# EasyEDA Pro project ProPrj_DSP BOARD_2026-03-01.epro, board PCB1
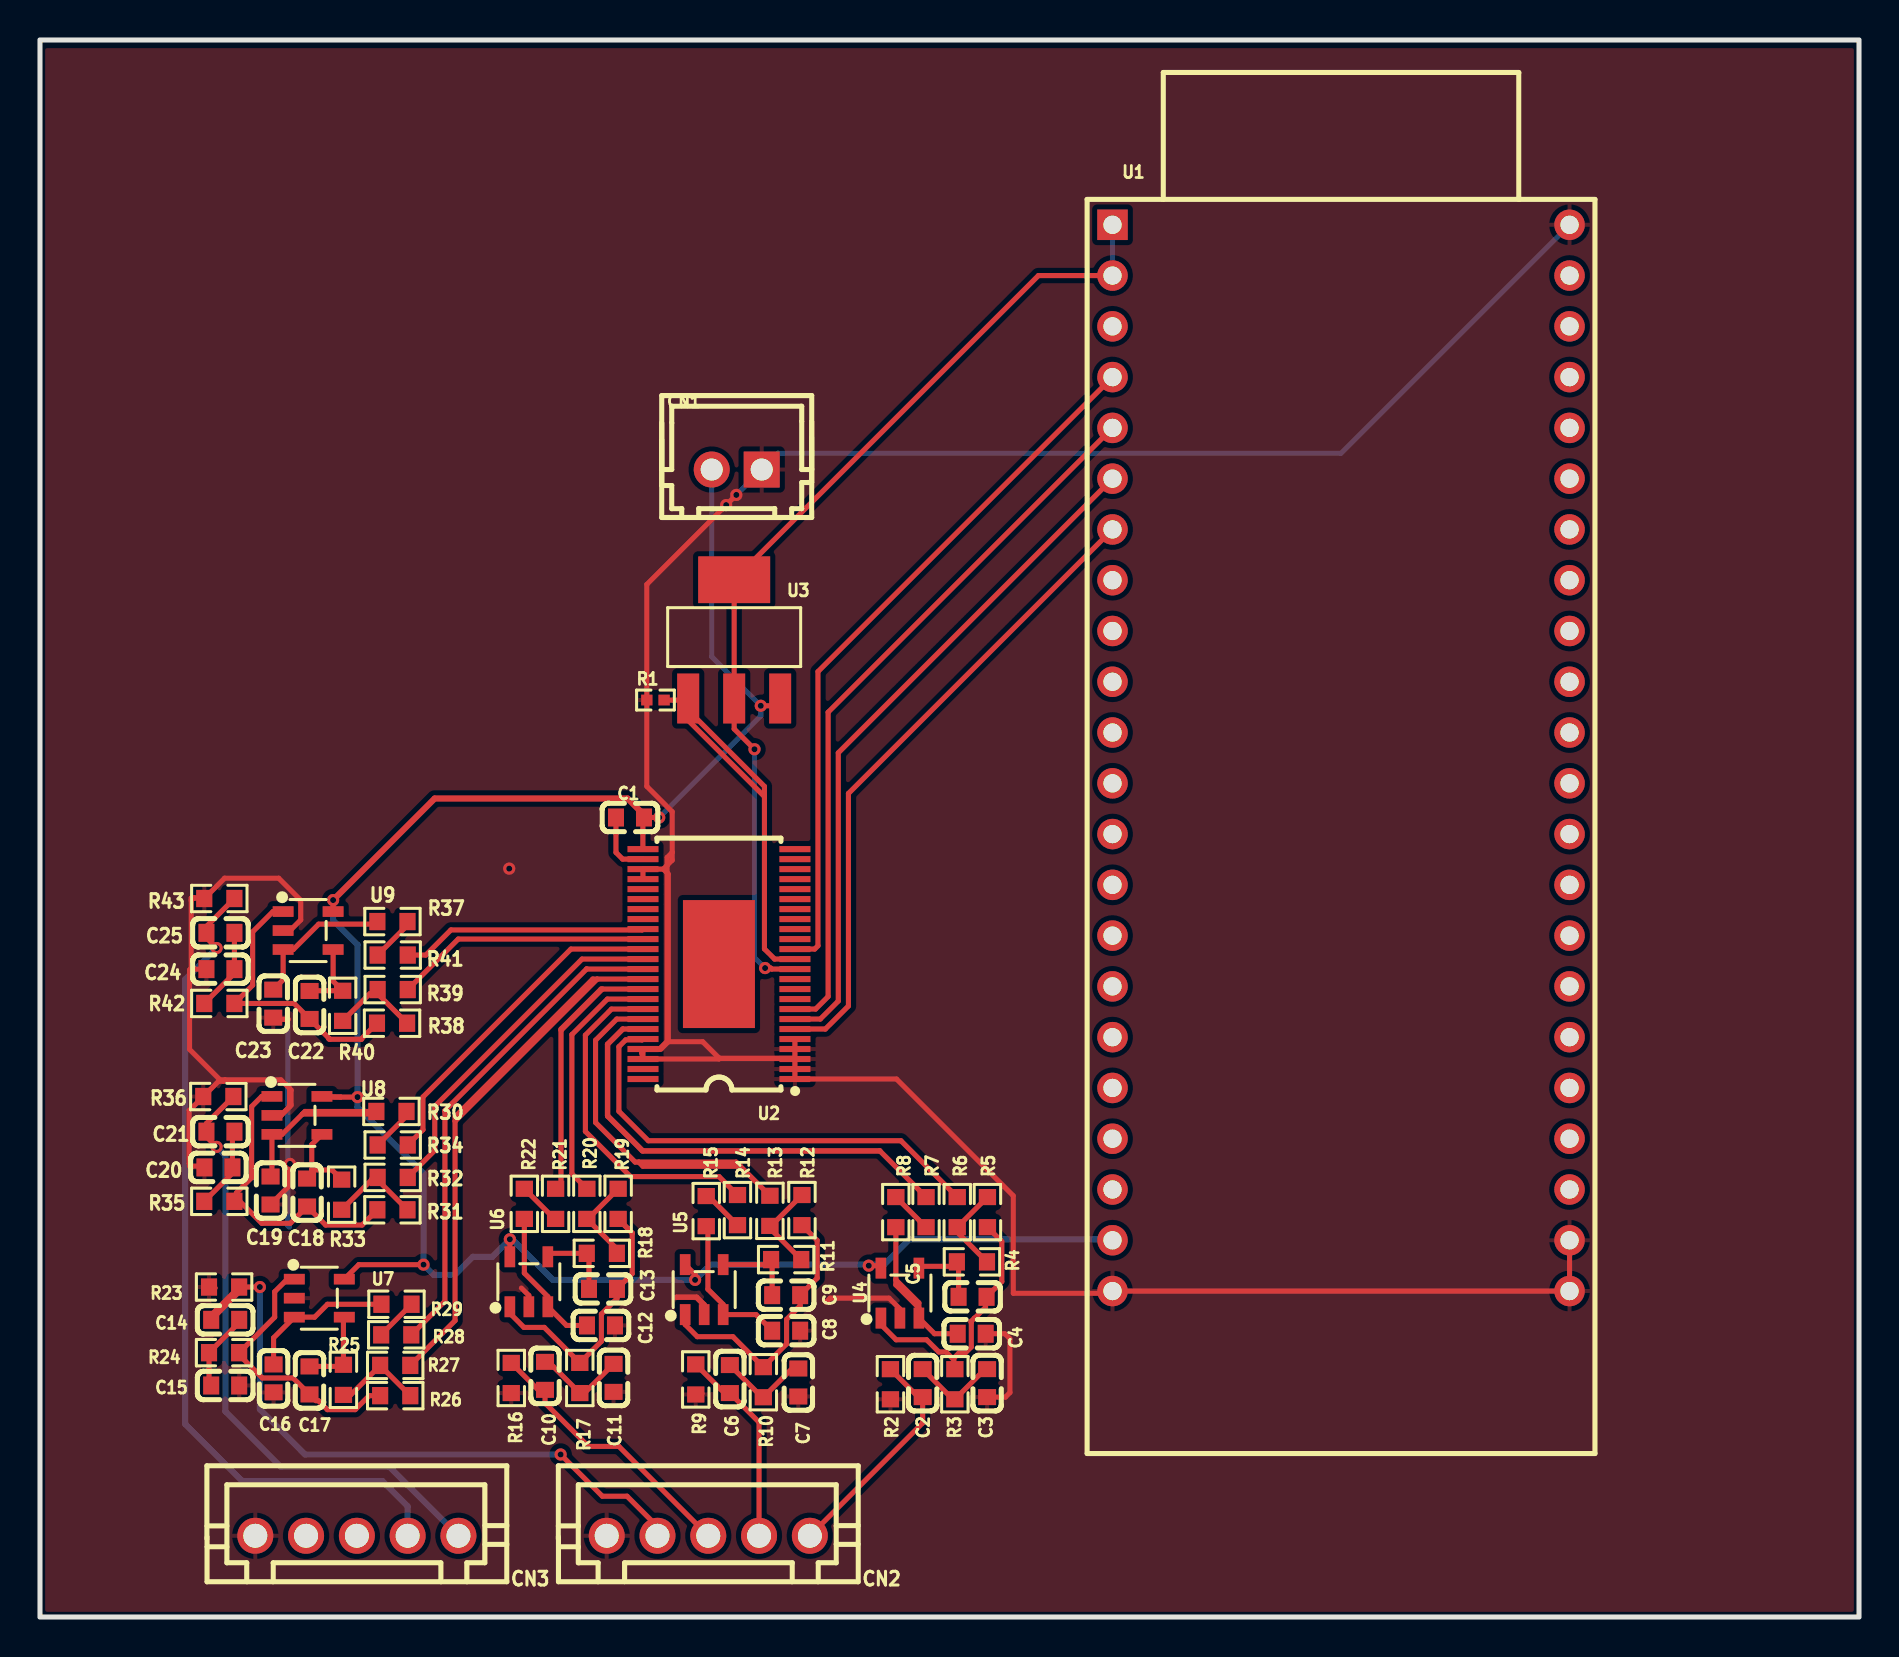
[diagram p2: board, top side]
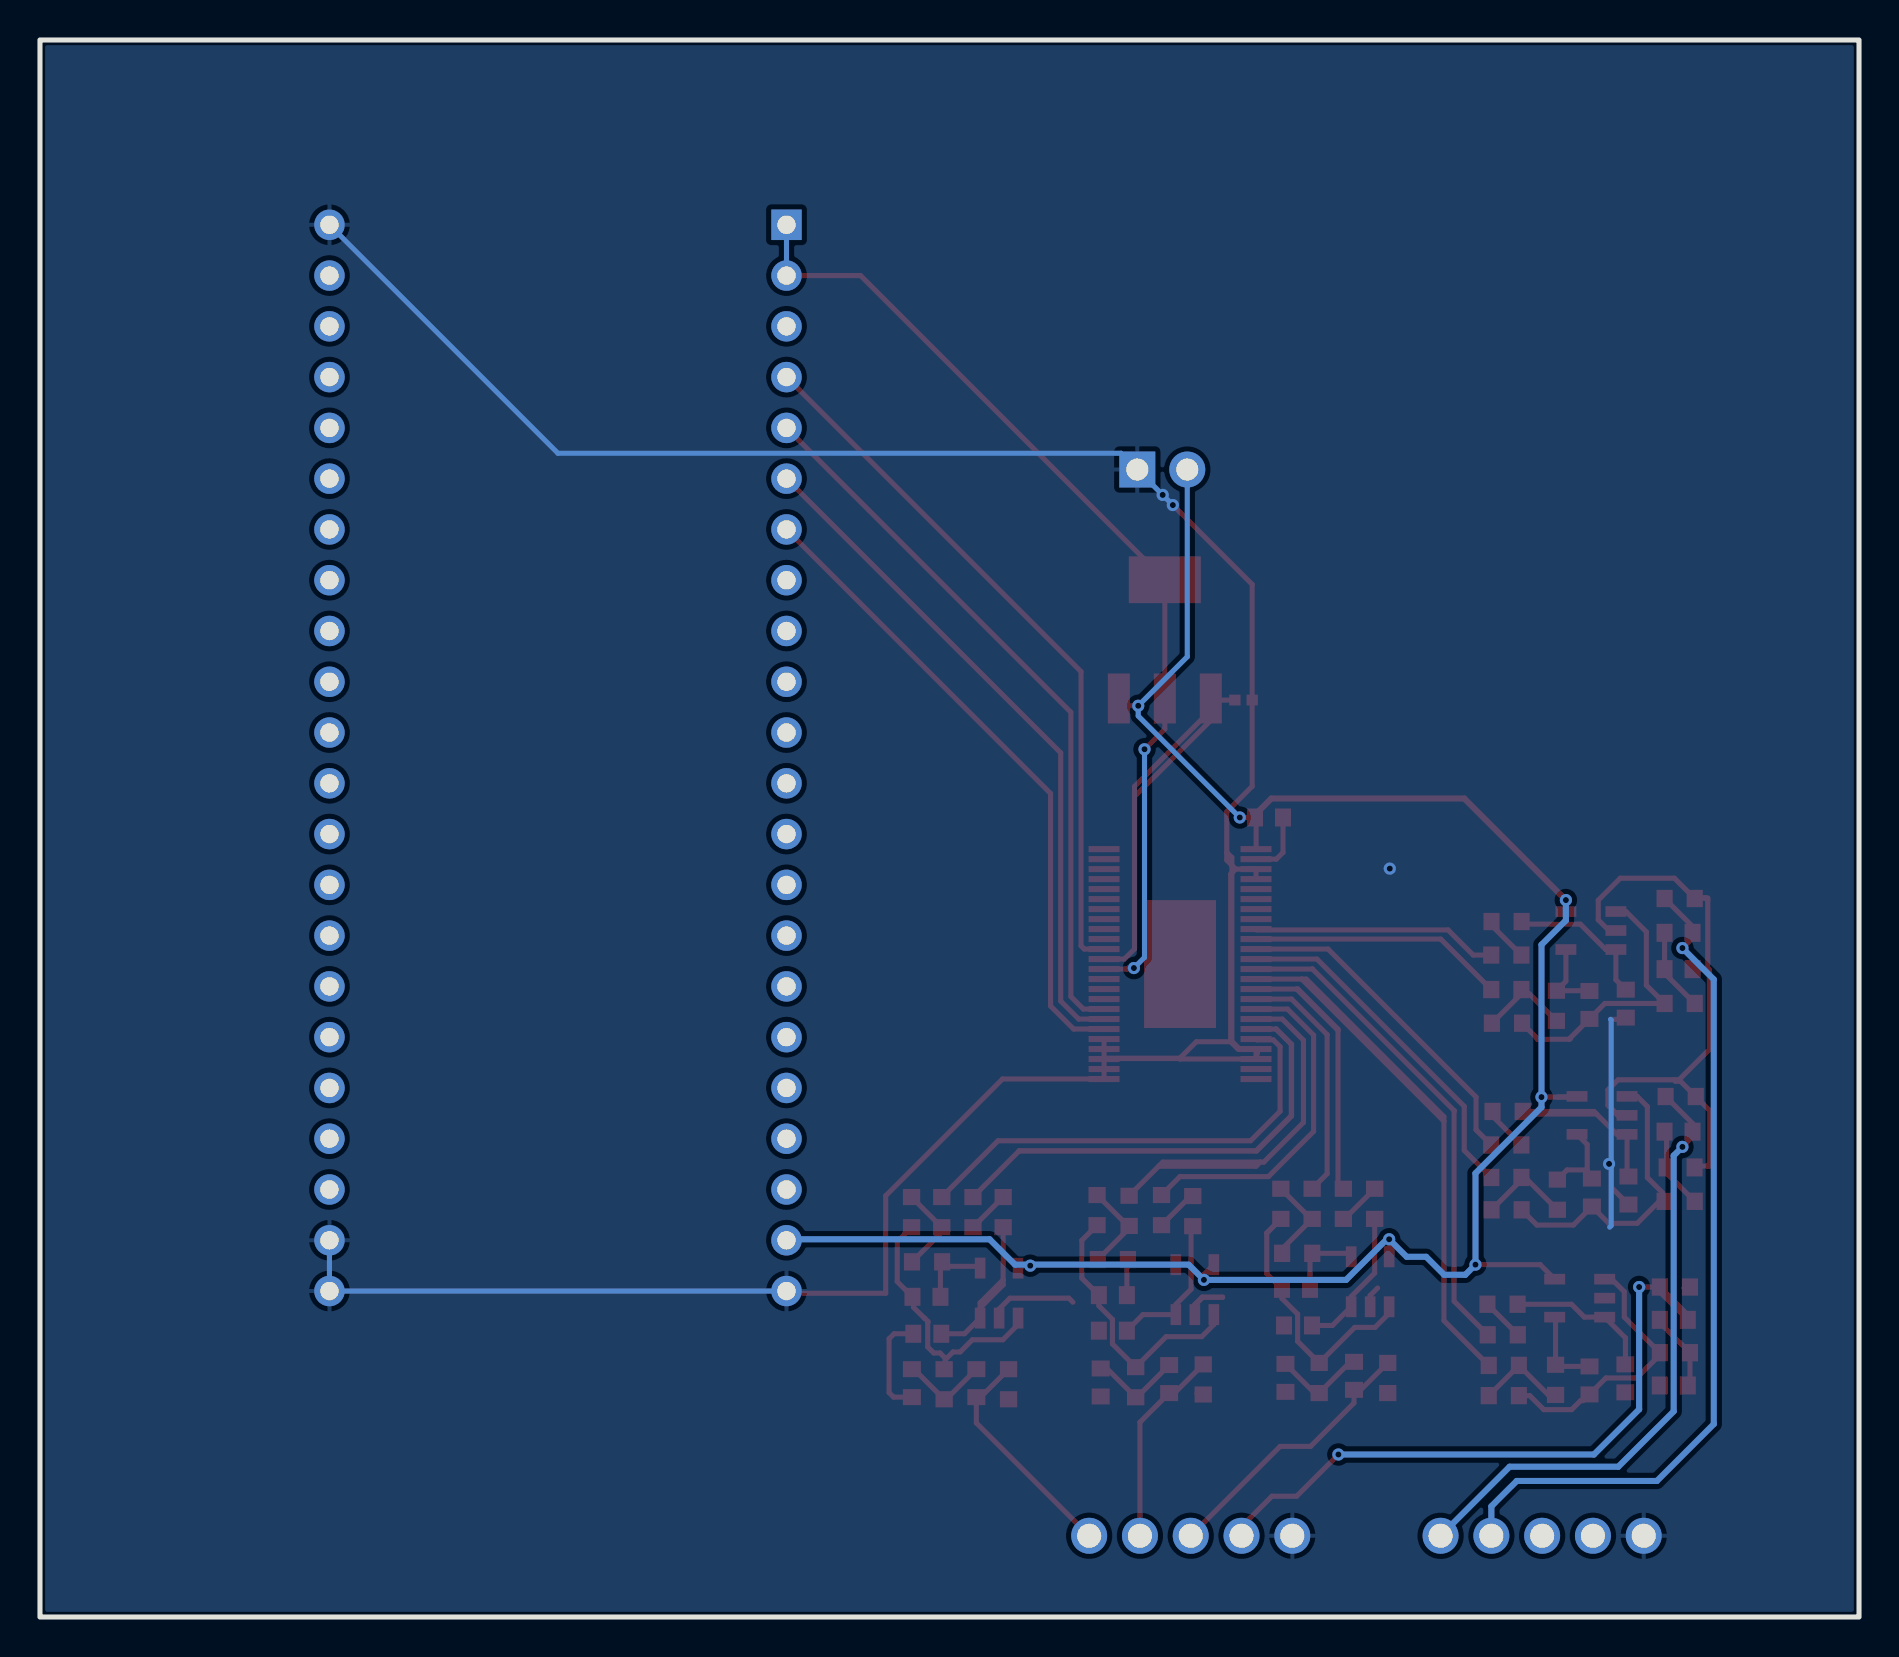
[diagram p3: board, bottom side, seen from below]

Outline 90.98 x 78.89 mm; copper layers: Top Layer, Bottom Layer. Coordinates in mm from the lower left corner of the outline.
Outline path: rectangle 0,78.89 90.98,0
Stack: Top Layer 0.035mm / Dielectric1 1.51mm FR4 er 4.5 / Bottom Layer 0.035mm

## Design rules (mm)
template: Custom Config
spacing copperThickness1oz: track to track 0.102, other pairs 0.152 to 0.3
spacing copperThickness2oz (default): track to track 0.203, other pairs 0.152 to 0.3
track width copperThickness1oz (default): min 0.127, default 0.254, max 2.54
track width copperThickness2oz: min 0.203, default 0.254, max 2.54
differential pair differentialPair (default): width min 0.127, default 0.254, max 2.54; gap min 0.152, default 0.152
via viaSize (default): diameter min 0.5, default 0.61, max 10; hole min 0.3, default 0.305, max 6.3

## Placement (name value [footprint] x y rotation side)
C1  10uF  [C0603]  29.51 40 180 top
C2  10uF  [C0603]  44.15 11.7 270 top
C3  330pF  [C0603]  47.37 11.7 270 top
C4  100pF  [C0603]  46.6 14.17 180 top
C5  100pF  [C0603]  46.65 16.02 0 top
C6  10uF  [C0603]  34.51 11.9 270 top
C7  330pF  [C0603]  37.93 11.73 270 top
C8  100pF  [C0603]  37.32 14.32 180 top
C9  100pF  [C0603]  37.32 16.1 0 top
C10  10uF  [C0603]  25.26 12.06 270 top
C11  330pF  [C0603]  28.69 11.96 270 top
C12  100pF  [C0603]  28.06 14.59 180 top
C13  100pF  [C0603]  28.16 16.41 0 top
C14  10uF  [C0603]  9.26 14.87 180 top
C15  330pF  [C0603]  9.26 11.58 0 top
C16  100pF  [C0603]  11.68 11.94 90 top
C17  100pF  [C0603]  13.48 11.84 270 top
C18  100pF  [C0603]  13.36 21.23 270 top
C19  100pF  [C0603]  11.53 21.34 90 top
C20  330pF  [C0603]  8.92 22.49 180 top
C21  10uF  [C0603]  9.03 24.28 180 top
C22  100pF  [C0603]  13.49 30.62 270 top
C23  100pF  [C0603]  11.67 30.68 90 top
C24  330pF  [C0603]  9.03 32.41 180 top
C25  10uF  [C0603]  9.03 34.23 180 top
CN1  ZX-XH2.54-2PZZ  [CONN-TH_2P-P2.50_HX25003-2A]  34.85 57.4 180 top
CN2  XH2.54-5P  [CONN-TH_5P-P2.54_C9900008095]  33.43 4.06 180 top
CN3  XH2.54-5P  [CONN-TH_5P-P2.54_C9900008095]  15.85 4.06 180 top
R1  0Ω  [R0402]  30.78 45.87 0 top
R2  47kΩ  [R0603]  42.54 11.64 90 top
R3  10kΩ  [R0603]  45.76 11.64 270 top
R4  10kΩ  [R0603]  46.61 17.77 180 top
R5  15kΩ  [R0603]  47.39 20.26 270 top
R6  10kΩ  [R0603]  45.88 20.26 270 top
R7  10kΩ  [R0603]  44.32 20.26 270 top
R8  15kΩ  [R0603]  42.81 20.26 270 top
R9  47kΩ  [R0603]  32.8 11.89 90 top
R10  10kΩ  [R0603]  36.18 11.75 270 top
R11  10kΩ  [R0603]  37.32 17.88 180 top
R12  15kΩ  [R0603]  38.11 20.36 270 top
R13  10kΩ  [R0603]  36.51 20.32 270 top
R14  10kΩ  [R0603]  34.89 20.36 270 top
R15  15kΩ  [R0603]  33.33 20.31 270 top
R16  47kΩ  [R0603]  23.57 11.96 90 top
R17  10kΩ  [R0603]  27 11.96 270 top
R18  10kΩ  [R0603]  28.1 18.19 180 top
R19  15kΩ  [R0603]  28.92 20.67 270 top
R20  10kΩ  [R0603]  27.35 20.67 270 top
R21  10kΩ  [R0603]  25.79 20.67 270 top
R22  15kΩ  [R0603]  24.23 20.67 270 top
R23  47kΩ  [R0603]  9.21 16.51 0 top
R24  10kΩ  [R0603]  9.21 13.22 180 top
R25  10kΩ  [R0603]  15.18 11.86 90 top
R26  15kΩ  [R0603]  17.77 11.07 180 top
R27  10kΩ  [R0603]  17.77 12.59 180 top
R28  10kΩ  [R0603]  17.82 14.12 180 top
R29  15kΩ  [R0603]  17.83 15.65 180 top
R30  15kΩ  [R0603]  17.58 25.29 180 top
R31  15kΩ  [R0603]  17.63 20.37 180 top
R32  10kΩ  [R0603]  17.64 21.99 180 top
R33  10kΩ  [R0603]  15.09 21.13 90 top
R34  10kΩ  [R0603]  17.64 23.61 180 top
R35  10kΩ  [R0603]  8.97 20.8 180 top
R36  47kΩ  [R0603]  8.92 26.04 0 top
R37  15kΩ  [R0603]  17.63 34.79 180 top
R38  15kΩ  [R0603]  17.61 29.7 180 top
R39  10kΩ  [R0603]  17.64 31.39 180 top
R40  10kΩ  [R0603]  15.14 30.58 90 top
R41  10kΩ  [R0603]  17.64 33.11 180 top
R42  10kΩ  [R0603]  8.97 30.69 180 top
R43  47kΩ  [R0603]  8.97 35.94 0 top
U1  ESP32-S3-DEVKITC-1-N8  [CONN-TH_ESP32-S3-DEVKITC-1U-N8]  65.07 42.98 0 top
U2  PCM1690DCAR  [HTSSOP-48_L12.5-W6.1-P0.50-LS8.1-BL-EP-1]  33.96 32.66 90 top
U3  AMS1117-3.3  [SOT-223-3_L6.5-W3.5-P3.05-LS7.0]  34.72 48.92 270 top
U4  OPA356AIDBVTG4  [SOT-23-5_L3.0-W1.5-P0.95-LS2.8-BL]  43.01 16.2 0 top
U5  OPA356AIDBVTG4  [SOT-23-5_L3.0-W1.5-P0.95-LS2.8-BL]  33.22 16.38 0 top
U6  OPA356AIDBVTG4  [SOT-23-5_L3.0-W1.5-P0.95-LS2.8-BL]  24.45 16.77 0 top
U7  OPA356AIDBVTG4  [SOT-23-5_L3.0-W1.5-P0.95-LS2.8-BL]  13.97 15.95 270 top
U8  OPA356AIDBVTG4  [SOT-23-5_L3.0-W1.5-P0.95-LS2.8-BL]  12.85 25.09 270 top
U9  OPA356AIDBVTG4  [SOT-23-5_L3.0-W1.5-P0.95-LS2.8-BL]  13.41 34.34 270 top

## Footprints (pads in the part's own frame, mm; a bottom-side part is the same pattern mirrored in y, then rotated)
C0603
  rect 0.8x0.9 smd: 1(-0.7,0) 2(0.7,0)
CONN-TH_2P-P2.50_HX25003-2A
  rect 1.8x1.8 hole 1.1: 1(-1.25,0)
  round 1.8 hole 1.1: 2(1.25,0)
CONN-TH_5P-P2.54_C9900008095
  round 1.8 hole 1.2: 1(-5.08,0) 2(-2.54,0) 3(0,0) 4(2.541,0) 5(5.08,0)
CONN-TH_ESP32-S3-DEVKITC-1U-N8
  rect 1.524x1.524 hole 0.914: 1(-11.43,26.67)
  round 1.524 hole 0.914: 2(-11.43,24.13) 3(-11.43,21.59) 4(-11.43,19.05) 5(-11.43,16.51) 6(-11.43,13.97) 7(-11.43,11.43) 8(-11.43,8.89) 9(-11.43,6.35) 10(-11.43,3.81) 11(-11.43,1.27) 12(-11.43,-1.27) 13(-11.43,-3.81) 14(-11.43,-6.35) 15(-11.43,-8.89) 16(-11.43,-11.43) 17(-11.43,-13.97) 18(-11.43,-16.51) 19(-11.43,-19.05) 20(-11.43,-21.59) 21(-11.43,-24.13) 22(-11.43,-26.67) 23(11.43,-26.67) 24(11.43,-24.13) 25(11.43,-21.59) 26(11.43,-19.05) 27(11.43,-16.51) 28(11.43,-13.97) 29(11.43,-11.43) 30(11.43,-8.89) 31(11.43,-6.35) 32(11.43,-3.81) 33(11.43,-1.27) 34(11.43,1.27) 35(11.43,3.81) 36(11.43,6.35) 37(11.43,8.89) 38(11.43,11.43) 39(11.43,13.97) 40(11.43,16.51) 41(11.43,19.05) 42(11.43,21.59) 43(11.43,24.13) 44(11.43,26.67)
HTSSOP-48_L12.5-W6.1-P0.50-LS8.1-BL-EP-1
  rect 0.305x1.55 smd: 1(-5.75,-3.8) 2(-5.25,-3.8) 3(-4.75,-3.8) 4(-4.25,-3.8) 5(-3.75,-3.8) 6(-3.25,-3.8) 7(-2.75,-3.8) 8(-2.25,-3.8) 9(-1.75,-3.8) 10(-1.25,-3.8) 11(-0.75,-3.8) 12(-0.25,-3.8) 13(0.25,-3.8) 14(0.75,-3.8) 15(1.25,-3.8) 16(1.75,-3.8) 17(2.25,-3.8) 18(2.75,-3.8) 19(3.25,-3.8) 20(3.75,-3.8) 21(4.25,-3.8) 22(4.75,-3.8) 23(5.25,-3.8) 24(5.75,-3.8) 25(5.75,3.8) 26(5.25,3.8) 27(4.75,3.8) 28(4.25,3.8) 29(3.75,3.8) 30(3.25,3.8) 31(2.75,3.8) 32(2.25,3.8) 33(1.75,3.8) 34(1.25,3.8) 35(0.75,3.8) 36(0.25,3.8) 37(-0.25,3.8) 38(-0.75,3.8) 39(-1.25,3.8) 40(-1.75,3.8) 41(-2.25,3.8) 42(-2.75,3.8) 43(-3.25,3.8) 44(-3.75,3.8) 45(-4.25,3.8) 46(-4.75,3.8) 47(-5.25,3.8) 48(-5.75,3.8)
  rect 6.4x3.6 smd: 49(0,0)
R0402
  rect 0.566x0.54 smd: 1(-0.433,0) 2(0.433,0)
R0603
  rect 0.806x0.864 smd: 1(-0.753,0) 2(0.753,0)
SOT-23-5_L3.0-W1.5-P0.95-LS2.8-BL
  rect 0.532x1.045 smd: 1(-0.95,-1.25) 2(0,-1.25) 3(0.95,-1.25) 4(0.95,1.25) 5(-0.95,1.25)
SOT-223-3_L6.5-W3.5-P3.05-LS7.0
  rect 2.5x1.1 smd: 1(2.97,-2.3) 2(2.97,0) 3(2.97,2.3)
  rect 2.34x3.6 smd: 4(-2.97,0)

## Nets
As in the schematic.

Pads without a net: U2 9 10 11 15 16 17 18 19 20 21 22 23 24 48 49

## Via types
v1: diameter 0.61, hole 0.305, Top Layer to Bottom Layer, 18 vias

## Routing (per net, layer and track width the routed paths; a pad name or vN(x,y) marks a point on that pad's centre or on a via; arc(x,y) is an arc through that point)
3V3: length 49.3
  Top Layer w0.254: v1(36.27,32.47) 36.55,32.47 36.6,32.41 U2.12 ; U1.2 49.94,67.11 U3.4 U3.2 34.72,44.43 v1(35.74,43.41)
  Bottom Layer w0.254: v1(35.74,43.41) 35.74,33 v1(36.27,32.47) ; U1.2 U1.1
+5V: length 109.7
  Top Layer w0.254: U7.5 15.95,17.63 v1(19.18,17.63) ; v1(23.5,18.9) U6.5 ; v1(36.05,45.58) 36.66,45.58 U3.3 ; v1(14.66,35.87) U9.5 ; 30.15,39.93 C1.1 ; 30.15,39.93 30.15,40.12 C1.1 ; 30.15,39.93 30.15,38.42 ; C1.1 v1(30.97,40) ; v1(41.45,17.58) 41.94,17.58 U4.5 ; 15.05,26.01 U8.5 14.14,26.01 15.05,26.01 ; 15.05,26.01 v1(15.88,26.01) ; U5.5 32.77,17.13 v1(32.77,16.87)
  Top Layer w0.305: 30.15,40.12 30.15,40.18 29.39,40.95 19.74,40.95 v1(14.66,35.87)
  Bottom Layer w0.254: v1(30.97,40) 36.05,45.08 v1(36.05,45.58) 33.6,48.04 CN1.2
  Bottom Layer w0.305: U1.21 53.59,18.9 43.48,18.9 42.21,17.63 41.5,17.63 v1(41.45,17.58) 41.4,17.63 33.53,17.63 v1(32.77,16.87) 25.65,16.87 23.62,18.9 v1(23.5,18.9) 22.62,18.02 21.65,18.02 20.75,17.12 19.69,17.12 v1(19.18,17.63) 19.18,22.2 15.88,25.5 v1(15.88,26.01) 15.88,33.63 14.66,34.85 v1(14.66,35.87)
AGND: length 246.6
  Top Layer w0.254: C19.1 12.39,21.5 12.39,22.56 v1(12.5,22.67) ; 31.37,37.61 31.18,37.41 ; 31.37,37.61 31.37,38 31.62,38.25 ; 31.37,37.61 31.62,37.86 31.62,38.25 ; 31.37,37.61 31.37,37.22 ; 31.18,37.41 31.37,37.22 ; 31.18,37.41 U2.27 U2.28 ; 31.62,38.25 31.62,40.28 30.35,41.55 R1.1 30.35,51.66 v1(34.32,55.63) v1(34.83,56.13) ; 31.37,37.22 31.37,28.8 30.98,28.41 ; 31.37,37.22 31.43,37.16 31.43,28.78 ; 12.05,25.09 U8.2 ; 12.05,25.09 12.48,25.53 12.48,26.44 ; 12.05,25.09 12.05,25.09 12.56,25.6 12.56,26.36 12.48,26.44 ; 12.48,26.44 12.05,26.87 9.25,26.87 ; 30.98,28.41 30.96,28.4 30.18,28.4 U2.45 ; 30.98,28.41 31.07,28.41 31.43,28.78 ; 30.98,28.41 U2.45 ; 8.13,35.86 8.22,35.86 R43.1 ; 8.13,35.86 8.02,35.97 ; 8.13,35.86 R43.1 ; 9.25,26.87 9.01,26.87 ; 9.25,26.87 9.18,26.8 8.93,26.8 ; 37.73,27.94 U2.3 ; 37.73,27.94 33.98,27.94 ; 37.73,27.94 37.72,27.95 34,27.95 33.98,27.94 ; U2.3 U2.4 U2.5 ; U2.3 U2.2 U2.1 42.84,26.91 48.68,21.07 48.68,16.2 53.53,16.2 U1.22 U1.23 U1.24 ; 33.98,27.94 33.96,27.91 U2.46 ; 33.98,27.94 33.15,28.78 31.43,28.78 ; 9.01,26.87 7.48,28.4 7.48,32.37 7.52,32.41 7.56,32.41 ; 9.01,26.87 8.93,26.8 ; 7.53,22.6 7.48,22.65 ; 7.53,22.6 7.48,22.55 7.48,22.65 ; 7.53,22.6 7.58,22.55 8.16,22.55 8.16,22.49 8.22,22.49 ; 7.48,22.65 7.46,22.67 7.46,25.33 R36.1 8.93,26.8 8.93,26.8 ; 7.67,35.97 8.02,35.97 ; 7.67,35.97 7.69,35.98 8.01,35.98 8.02,35.97 ; 7.67,35.97 7.56,35.86 ; 7.67,35.97 7.56,35.97 7.56,35.86 ; 39.32,15.75 39.52,15.95 42.47,15.95 43.01,15.41 U4.2 ; 33.22,15.6 32.82,16 31.83,16 31.84,16 32.85,16 33.22,15.64 33.22,15.6 ; 33.22,15.6 U5.2 ; U2.46 30.1,28.21 30.1,28.35 U2.45 ; U2.46 U2.45 ; R43.1 9.23,36.96 11.94,36.96 13.04,35.86 13.04,34.87 12.51,34.34 U9.2 ; U6.2 24.45,16.09 24.08,16.46 ; 7.56,35.86 7.56,32.41 ; 7.56,32.41 C24.2 ; 12.43,29.9 11.75,29.9 C23.1 ; C4.1 48.26,14.17 48.51,13.92 48.51,11.23 48.29,11 C3.2 ; 33.11,11.18 R9.1 32.97,11.3 32.97,11.32 33.11,11.18 ; 42.67,11.03 42.4,11.03 R2.1 42.67,11.03 ; 8.5,16.46 R23.1 8.75,16.46 8.5,16.46
  Bottom Layer w0.254: v1(34.32,55.63) v1(34.83,56.13) CN1.1 36.91,58.22 65.07,58.22 U1.44 ; U1.22 U1.23 U1.24 ; 12.47,19.5 12.39,19.58 12.39,29.86 12.43,29.9
  vias: v1(23.47,37.44)
DGND: length 22.9
  Top Layer w0.254: 36.24,41.04 36.24,41.55 32.43,45.36 ; 36.24,41.04 36.24,33.42 36.74,32.91 U2.13 ; 36.24,41.04 32.43,44.85 32.43,45.36 ; 32.43,45.87 31.22,45.87 ; 32.43,45.87 U3.1 ; 32.43,45.87 32.43,45.36
GPI04: length 35.8
  Top Layer w0.254: U2.14 38.75,33.41 38.91,33.58 38.91,47.29 U1.4
GPI05: length 36.3
  Top Layer w0.254: U2.8 38.8,30.41 39.42,31.04 39.42,45.26 U1.5
GPI06: length 34.4
  Top Layer w0.254: U1.6 39.93,43.23 39.93,30.81 39.03,29.91 U2.7
GPI07: length 32.5
  Top Layer w0.254: 53.64,54.41 40.44,41.2 40.44,30.57 39.28,29.41 U2.6
OUT1: length 11.5
  Top Layer w0.254: 38.51,4.06 44.15,9.71 C2.2 43.93,11 R2.2
OUT2: length 10
  Top Layer w0.254: CN2.2 35.97,9.74 C6.2 34.23,11.2 R9.2
OUT3: length 13.8
  Top Layer w0.254: CN2.3 28.96,8.53 27.43,8.53 25.26,10.71 C10.2 24.92,11.36 R16.2
OUT4: length 34.4
  Top Layer w0.254: v1(11,16.51) R23.2 ; R23.2 8.56,15.11 C14.2 9.96,16.26 R23.2 ; v1(26.04,8.13) 28.13,6.04 29.36,6.04 30.89,4.52 30.89,4.06
  Bottom Layer w0.305: v1(26.04,8.13) 13.26,8.13 11,10.39 v1(11,16.51)
OUT5: length 30.9
  Top Layer w0.254: v1(8.83,23.52) 8.33,24.03 C21.2 8.33,24.69 R36.2
  Bottom Layer w0.305: v1(8.83,23.52) 9.27,23.08 9.27,10.29 12.04,7.52 17.47,7.52 CN3.1
OUT6: length 42
  Top Layer w0.254: R43.2 8.33,34.55 C25.2 8.33,33.97 v1(8.83,33.47)
  Bottom Layer w0.305: CN3.2 18.39,5.54 17.12,6.81 10.11,6.81 7.26,9.65 7.26,31.9 v1(8.83,33.47)
OUT_1N: length 23.3
  Top Layer w0.254: R6.1 43.06,23.82 30.43,23.82 28.96,25.3 28.96,28.53 29.29,28.87 30.12,28.87 U2.44
OUT_1P: length 42.3
  Top Layer w0.254: 29.16,29.41 28.4,28.65 28.4,25.08 ; 29.16,29.41 U2.43 ; 29.16,29.41 29.14,29.41 28.38,28.65 28.38,25.1 28.4,25.08 ; 28.4,25.08 30.16,23.32 42.01,23.32 42.01,23.32 ; 28.4,25.08 28.4,25.04 30.12,23.32 42.01,23.32 ; 42.01,23.32 R7.1
OUT_2N: length 22.3
  Top Layer w0.254: U2.42 28.85,29.91 27.79,28.85 27.79,24.74 29.77,22.76 29.95,22.76 ; 29.95,22.76 34.82,22.76 35.03,22.55 ; 29.95,22.76 30.16,22.55 35.03,22.55 ; 35.03,22.55 R13.1
OUT_2P: length 17.2
  Top Layer w0.254: U2.41 28.59,30.41 27.28,29.11 27.28,24.29 29.54,22.03 33.96,22.03 R14.1
OUT_3N: length 12.3
  Top Layer w0.254: U2.40 28.38,30.91 26.6,29.14 26.6,22.17 R20.1
OUT_3P: length 16
  Top Layer w0.254: R21.1 26.06,21.69 26.06,29.35 ; 28.13,31.41 U2.39 ; 28.13,31.41 28.06,31.41 26.06,29.41 26.06,29.35 ; 28.13,31.41 26.06,29.35
OUT_4N: length 35.7
  Top Layer w0.254: U2.38 27.87,31.91 ; 27.87,31.91 20.76,24.8 ; 27.87,31.91 27.65,31.91 20.76,25.03 20.76,24.8 ; 20.76,24.8 20.76,14.83 R27.1
OUT_4P: length 24.8
  Top Layer w0.254: 27.35,32.43 27.33,32.41 ; 27.33,32.41 U2.37 ; 27.33,32.41 20.25,25.33 ; 20.25,25.33 20.24,25.32 ; 20.25,25.33 20.25,15.8 R28.1
OUT_5N: length 17.6
  Top Layer w0.254: R32.1 19.75,23.34 19.75,25.55 27.11,32.91 U2.36
OUT_5P: length 16.8
  Top Layer w0.254: R34.1 19.16,24.38 19.16,26.01 26.56,33.41 U2.35
OUT_6N: length 12.8
  Top Layer w0.254: U2.34 20.92,33.91 R39.1
OUT_6P: length 12.3
  Top Layer w0.254: R41.1 19.3,33.11 20.55,34.37 30.12,34.37 U2.33
$1N5043: length 3.2
  Top Layer w0.254: 28.81,40 28.81,38.25 29.14,37.91 U2.26
$1N12831: length 4
  Top Layer w0.254: 45.95,17.54 R4.2 45.95,17.68 45.95,17.54 ; 45.95,17.54 44.05,17.54 U4.4 ; 45.95,17.54 C5.1
$1N12836: length 4.5
  Top Layer w0.254: R4.1 45.88,19.25 R6.2 ; 45.88,19.5 R5.1
$1N12844: length 2.1
  Top Layer w0.254: 44.31,19.5 R8.1
$1N12849: length 9.2
  Top Layer w0.254: 42.81,16.87 R8.2 ; 42.81,16.87 42.81,16.61 43.96,15.46 ; 42.81,16.87 43.96,15.72 43.96,15.46 ; 43.96,15.46 U4.3 44.74,14.17 C4.2
$1N12960: length 13.2
  Top Layer w0.254: R3.1 45.71,12.45 45.71,12.95 45.96,13.21 46.28,13.21 46.58,13.51 46.58,14.74 46.57,14.75 46.57,14.79 46.74,14.95 46.75,14.95 47.29,15.5 47.29,15.97 C5.2 48.11,16.78 48.11,18.78 R5.2 ; 45.65,12.93 45.32,13.26 44.96,13.26 44.35,13.87 42.82,13.87 42.06,14.63 U4.1
$1N13165: length 4.5
  Top Layer w0.254: C3.1 47.27,12.4 R3.2 45.66,10.89 C2.1
$1N14184: length 4.2
  Top Layer w0.254: C9.1 36.62,17.63 ; 36.62,17.63 34.17,17.63 ; 36.62,17.63 R11.2
$1N14188: length 4.6
  Top Layer w0.254: 38.07,17.88 36.59,19.37 36.59,19.59 ; R12.1 36.59,19.59 ; 36.59,19.59 R13.2
$1N14195: length 7.6
  Top Layer w0.254: R15.2 33.41,19.47 33.41,16.4 34.17,15.64 34.17,15.13 35.82,15.13 C8.2
$1N14202: length 4.7
  Top Layer w0.254: C7.1 37.62,12.43 R10.2 36.12,10.99 C6.1
$1N14213: length 2.2
  Top Layer w0.254: R15.1 33.43,21.06 R14.2
$1N14217: length 13.7
  Top Layer w0.254: U5.1 32.27,14.63 32.88,14.02 34.66,14.02 R10.1 37.34,13.66 37.34,14.89 38.02,15.57 C9.2 ; R12.2 38.87,18.84 38.87,16.95 38.11,16.19
$1N20006: length 4.6
  Top Layer w0.254: R25.1 15.54,11.11 17.01,12.59 ; 17.01,12.58 R26.1
$1N20009: length 7.4
  Top Layer w0.254: C16.2 11.68,13.97 U7.3 13.74,15 14.38,15.65 R29.2
$1N20011: length 4.1
  Top Layer w0.254: U7.4 15.18,14.96 R25.2 15.1,12.54 C17.1
$1N20014: length 2.2
  Top Layer w0.254: R29.1 17.06,14.13 R28.2
$1N20015: length 13.2
  Top Layer w0.254: U7.1 12.37,16.9 11.74,16.27 11.74,15 R24.1 9.96,13.12 11.12,11.96 12.66,11.96 C17.2 ; 13.8,10.82 13.93,10.82 14.37,10.37 15.77,10.37 16.47,11.07 17.01,11.07
$1N20016: length 14.4
  Top Layer w0.254: 29.62,19.2 28.92,19.92 29.62,19.21 29.62,19.2 ; 29.62,19.2 29.62,17.18 C13.2 28.86,15.93 28.08,15.15 28.08,13.79 R17.1 25.22,14.49 24.21,14.49 23.5,15.19 U6.1
$1N20019: length 4.7
  Top Layer w0.254: C10.1 25.44,12.76 R17.2 27.23,11.2 C11.1
$1N20024: length 4
  Top Layer w0.254: C15.1 8.45,11.69 R24.2 9.96,14.73 C14.1
$1N20031: length 7.2
  Top Layer w0.254: 24.23,19.92 24.23,17.2 25.4,16.03 U6.3 26.34,14.59 C12.2
$1N20032: length 2.2
  Top Layer w0.254: 25.79,19.92 25.73,19.92 R22.1
$1N20035: length 4.5
  Top Layer w0.254: R19.1 27.41,19.92 27.35,19.92 28.85,18.42 28.85,18.19
$1N20036: length 3.8
  Top Layer w0.254: C13.1 27.46,18.08 R18.2 25.57,18.19 U6.4
$1N26516: length 4.1
  Top Layer w0.254: C21.1 9.62,24.18 C20.1 9.62,22.2 R35.2
$1N26519: length 11.6
  Top Layer w0.254: 13.13,25.16 16.69,25.16 16.82,25.29 13.26,25.29 13.13,25.16 ; 13.13,25.16 12.11,24.14 U8.3 11.6,22.11 C19.2
$1N26520: length 2.3
  Top Layer w0.254: R30.1 18.33,25.06 R34.2
$1N26521: length 4.8
  Top Layer w0.254: 16.61,21.89 R33.1 ; 16.61,21.89 16.58,21.89 ; 16.61,21.89 16.86,21.89 ; 16.89,21.89 16.86,21.89 ; 16.86,21.89 R32.2 16.89,21.86 ; 16.86,21.89 16.89,21.86 ; R31.1 16.89,21.86
$1N26522: length 15.1
  Top Layer w0.254: U8.1 11.09,26.04 10.59,25.54 10.59,21.98 9.82,21.22 9.82,20.97 ; 9.82,20.97 9.86,20.93 ; 9.82,20.97 R35.1 9.86,20.93 ; 9.86,20.93 11.09,19.69 12.52,19.69 C18.2 14.29,19.61 16.11,19.61 R31.2
$1N26524: length 4.2
  Top Layer w0.254: 15.09,21.88 14.6,22.37 13.59,22.37 ; 13.59,22.37 13.59,23.64 U8.4 ; 13.59,22.37 13.59,22.17 C18.1
$1N26990: length 4.2
  Top Layer w0.254: R42.2 9.73,32.2 C24.1 C25.1
$1N26993: length 7.5
  Top Layer w0.254: C23.2 12.16,31.88 U9.3 12.67,33.39 13.94,34.66 16.74,34.66 R37.2
$1N26994: length 2.3
  Top Layer w0.254: R37.1 18.38,34.61 R41.2
$1N26995: length 4.6
  Top Layer w0.254: R40.1 16.5,31.18 16.89,31.18 ; 16.89,31.18 R39.2 ; 16.89,31.18 R38.1
$1N26996: length 14.2
  Top Layer w0.254: U9.1 11.65,35.29 10.64,34.27 10.64,31.61 R42.1 12.71,30.69 C22.2 14.46,28.94 ; 16.05,28.9 16.09,28.9 ; 16.05,28.9 14.5,28.9 ; 16.05,28.9 R38.2 ; 14.5,28.9 14.46,28.94 ; 14.5,28.9 14.46,28.9 ; 14.46,28.94 14.43,28.94
$1N26998: length 3.9
  Top Layer w0.254: U9.4 14.66,31.81 R40.2 13.5,31.33 C22.1

## Copper pours and planes (outline as drawn; the poured copper is in the pictures)
AGND on Top Layer: -1.17,78.49 91.39,78.49 91.39,-0.51 -1.17,-0.51
AGND on Bottom Layer: -1.73,82.14 92.91,82.14 92.91,-0.81 -1.73,-0.81
